# EAGLE design GU154X39LOL (EAGLE 9.6.1)
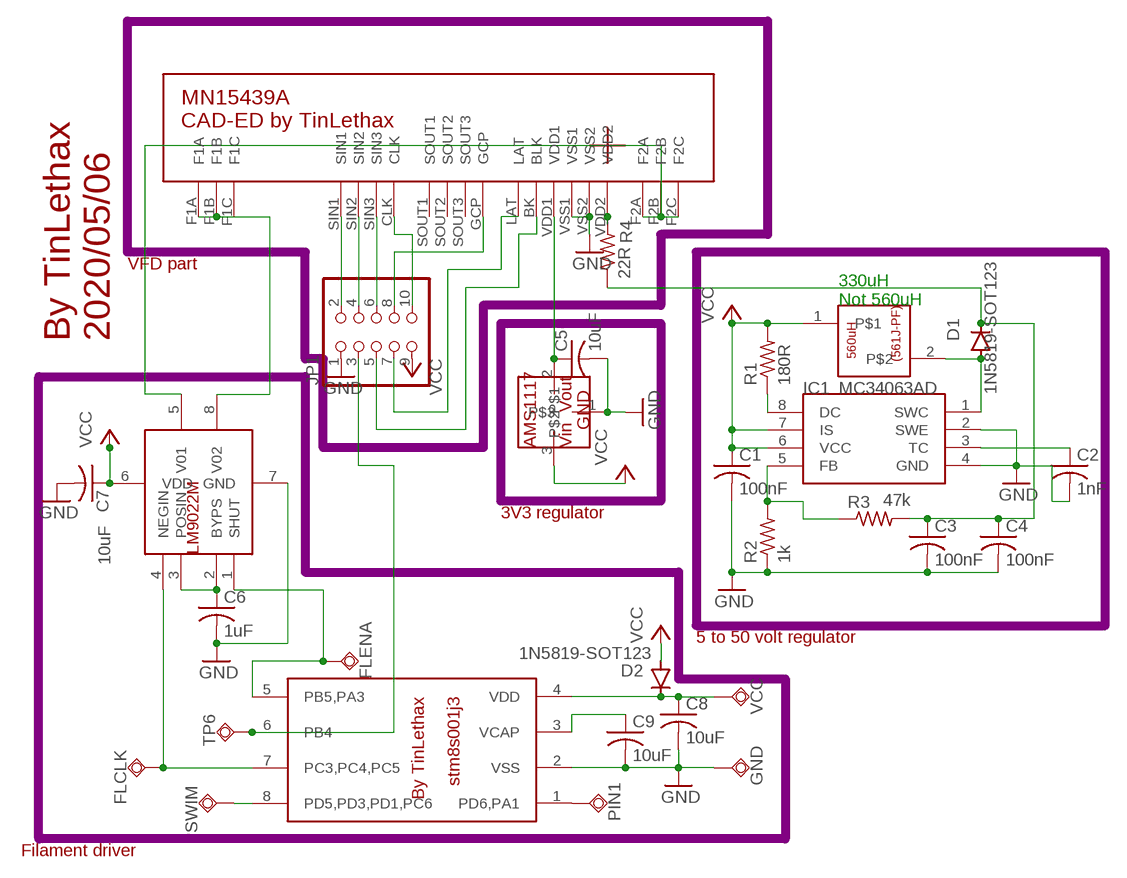
[diagram p0: schematic, sheet 1]

## Parts
330UH1210  330uH  NL453232T-561J-PF  [INDC4526X50N]
C1  100nF  C-USC1206K  [C1206K]
C2  1nF  C-USC0805  [C0805]
C3  100nF  C-USC1206K  [C1206K]
C4  100nF  C-USC1206K  [C1206K]
C5  10uF  C-USC0805  [C0805]
C6  1uF  C-USC0805  [C0805]
C7  10uF  C-USC0805  [C0805]
C8  10uF  C-USC0805  [C0805]
C9  10uF  C-USC0805  [C0805]
D1  1N5819-SOT123  CGRM400-G  [SOD-123_MINI-SMA]
D2  1N5819-SOT123  CGRM400-G  [SOD-123_MINI-SMA]
FLCLK  TPSQTP20SQ  [TP20SQ]
FLENA  TPSQTP20SQ  [TP20SQ]
GND  TPSQTP20SQ  [TP20SQ]
IC1  MC34063AD  [SOIC8]
IC2  STM8S001J3  [SOP8]
IC3  LM9022M  [SOIC127P590X265-8N]
IC4  AMS1117  [SOT223]
JP1  PINHD-2X5  [2X05]
PIN1  TPSQTP20SQ  [TP20SQ]
R1  180R  R-US_R0805  [R0805]
R2  1k  R-US_R0805  [R0805]
R3  47k  R-US_R0805  [R0805]
R4  22R  R-US_R0805  [R0805]
SWIM  TPSQTP20SQ  [TP20SQ]
TP6  TPSQTP20SQ  [TP20SQ]
U$1  MN15439A  [THT-20]
VCC  TPSQTP20SQ  [TP20SQ]

## Nets
GND: C1.2 C2.2 C3.2 C4.2 C5.2 C6.2 C7.2 C8.2 C9.2 GND.TP IC1.2(SWE) IC1.4(GND) IC2.2(VSS) IC3.7(GND) IC4.1 JP1.1 R2.1 U$1.VSS1 U$1.VSS2
N$1: IC1.8(DC) R1.1
N$2: IC1.5(FB) R2.2 R3.1
N$3: 330UH1210.2 D1.A IC1.1(SWC)
N$4: C3.1 C4.1 D1.C R3.2 R4.1
N$5: C2.1 IC1.3(TC)
N$6: C5.1 IC4.2 U$1.VDD1
N$7: IC3.5(V01) U$1.F2A U$1.F2B U$1.F2C
N$8: IC3.8(V02) U$1.F1A U$1.F1B U$1.F1C
N$9: R4.2 U$1.VDD2
N$10: JP1.2 U$1.SIN1
N$11: JP1.4 U$1.SIN2
N$12: JP1.6 U$1.SIN3
N$13: JP1.10 U$1.CLK
N$14: JP1.8 U$1.GCP
N$15: JP1.7 U$1.LAT
N$16: JP1.5 U$1.BK(BLK)
N$17: FLCLK.TP IC2.7(PC3,PC4,PC5) IC3.4(NEGIN)
N$18: C6.1 IC3.2(BYPS) IC3.3(POSIN)
N$19: FLENA.TP IC2.5(PB5,PA3) IC3.1(SHUT)
N$20: IC2.8(PD5,PD3,PD1,PC6) SWIM.TP
N$21: C8.1 D2.C IC2.4(VDD) VCC.TP
N$23: C9.1 IC2.3(VCAP)
N$25: IC2.1(PD6,PA1) PIN1.TP
N$26: IC2.6(PB4) JP1.3 TP6.TP
VCC: 330UH1210.1 C1.1 C7.1 D2.A IC1.6(VCC) IC1.7(IS) IC3.6(VDD) IC4.3 JP1.9 R1.2
Unconnected: U$1.SOUT1 U$1.SOUT2 U$1.SOUT3

## Notes on the sheet
- VFD part
- 330uH
  Not 560uH
- By TinLethax
  2020/05/06
- 3V3 regulator
- 5 to 50 volt regulator
- Filament driver

## Library data of the parts
330UH1210 = 561J-PF:NL453232T-561J-PF
C1 C3 C4 = adafruit:C-US: CAPACITOR, American symbol
C2 C5-C9 = capsmd:C-US: CAPACITOR, American symbol; SPICEPREFIX: C
D1 D2 = diode:CGRM400*-G: Molded plasitc,JEDEC SOD-123/Mini SMA Source: Comchip CGRM4001-G.pdf
FLCLK FLENA GND PIN1 SWIM TP6 VCC = testpad:TPSQ: Test pad
IC1 = mc34063:MC34063
IC2 = stm8s001j3:STM8S001J3
IC3 = LM9022:LM9022M: The LM9022 is a bridged power amplifier capable of delivering typically 2W of continuous average power into a 10Ω filament load when powered by a 5V power supply. To conserve power in portable applications, the LM9022’s micropower shutdown mode (IQ = 0.6µA, typ) is activated when VDD is applied to the SHUTDOWN pin. Additional LM9022 features include thermal shutdown protection, unity-gain stability, and external gain set; PARTNO: LM9022
IC4 = AMS1117:AMS1117: The The AMS1117 series of adjustable and fixed voltage regulators are designed to provide up to1A output current and to operate down to 1V input-to-output differential. The dropout voltage of the device is guaranteed maximum 1.3V, decreasing at lower load currents.; PARTNO: AMS1117
JP1 = pinhead:PINHD-2X5: PIN HEADER
R1-R4 = adafruit:R-US_: RESISTOR, American symbol
U$1 = MN15439A:MN15439A: This VF glass includes 3x 286 bit serial shift registers, PWM decoder and latched driver which connects to the anode and grid electrodes. An external host is required to provide a multiplexing data stream to refresh the display. The signal inputs can be connected to the ports of a CMOS microprocessor. The a.c. filament supply (F1, F2) can be derived from a source of 10KHz to 200KHz. Consult our application notes for further information.; PARTNO: MN15439A

## Board
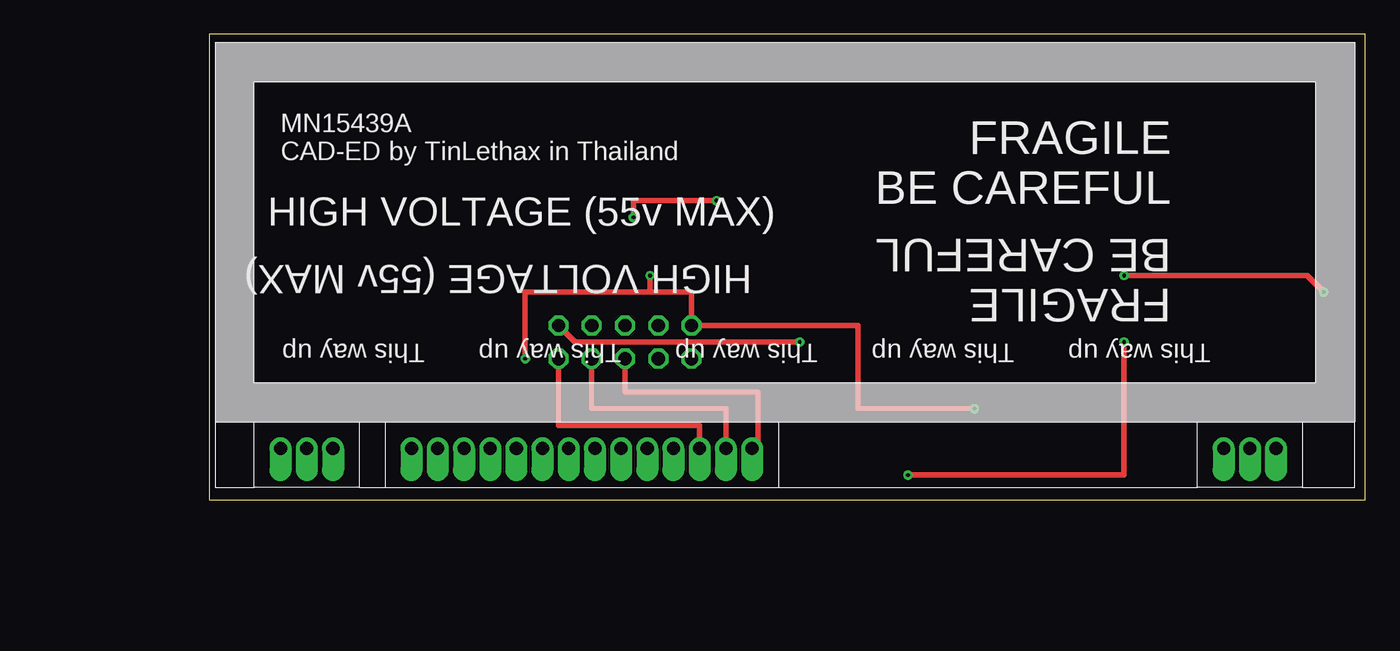
[diagram p1: board, top side]
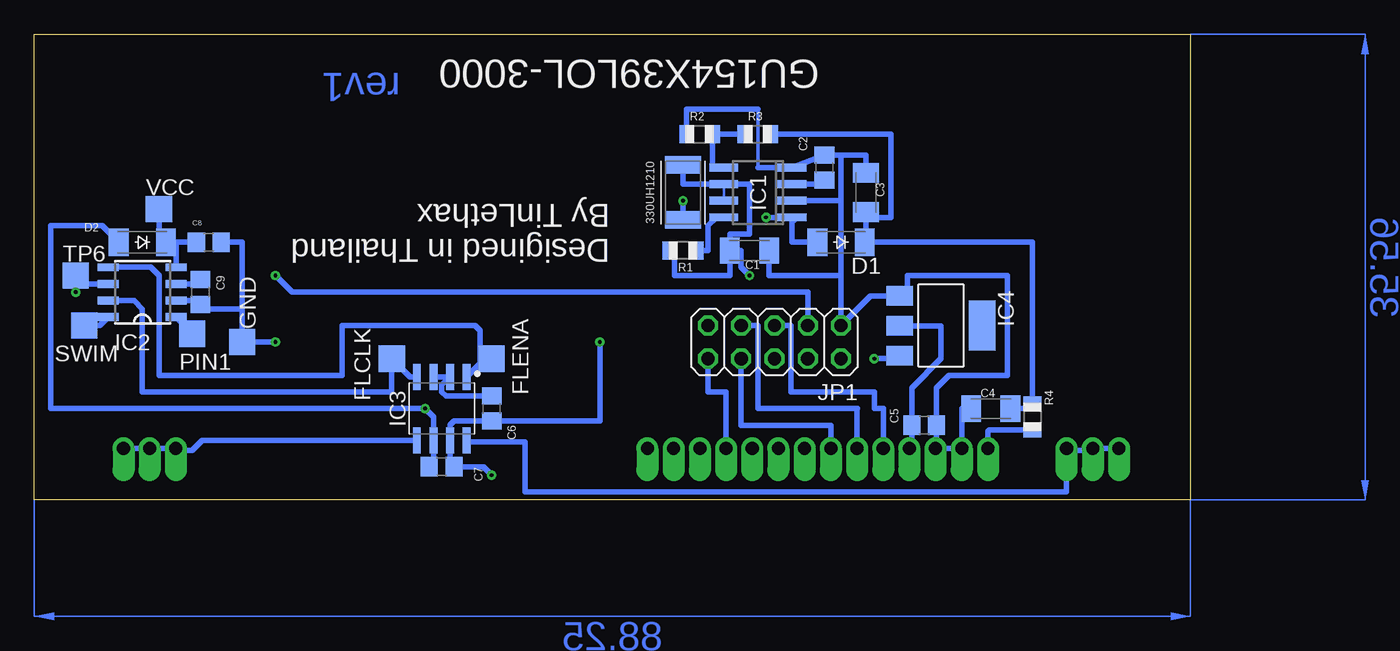
[diagram p2: board, bottom side, seen from below]

Size 88.25 x 35.56 mm. Coordinates in mm from the lower left corner, seen from the top.
Outline: 0,0 88.25,0 88.25,35.56 0,35.56 0,0
Copper layers (1*16): Top 0.035mm / dielectric 1.5mm / Bottom 0.035mm
Design rules "default": minimum track width 6mil, minimum drill 0.35mm, track to track 6mil, track to pad 6mil, pad to pad 6mil, via to via 6mil, smd to smd 6mil, copper to edge 40mil, drill to drill 6mil, minimum pad ring 10mil, minimum via ring 8mil, stop-mask expansion 4mil, vias tented up to drill 0mil, thermal gap 10mil

### Footprints (pad centres in the part's own frame; a part is rotated, then mirrored left to right if it is on the bottom)
INDC4526X50N = smd 1.314 x 2.729: 1 -2.098,0; 2 2.098,0
C1206K = smd 1.5 x 2: 1 -1.5,0; 2 1.5,0
C0805 = smd 1.3 x 1.5: 1 -0.95,0; 2 0.95,0
SOD-123_MINI-SMA = smd 1.5 x 2.1: A 1.8,0; C -1.8,0
TP20SQ = smd 2 x 2: TP 0,0
SOIC8 = smd 0.6 x 2.2: 1 -1.905,-2.6; 2 -0.635,-2.6; 3 0.635,-2.6; 4 1.905,-2.6; 5 1.905,2.6; 6 0.635,2.6; 7 -0.635,2.6; 8 -1.905,2.6
SOP8 = smd 0.6 x 1.6: 1 -1.905,-2.6; 2 -0.635,-2.6; 3 0.635,-2.6; 4 1.905,-2.6; 5 1.905,2.6; 6 0.635,2.6; 7 -0.635,2.6; 8 -1.905,2.6
SOIC127P590X265-8N = smd 1.968 x 0.602: 1 -2.423,1.905; 2 -2.423,0.635; 3 -2.423,-0.635; 4 -2.423,-1.905; 5 2.423,-1.905; 6 2.423,-0.635; 7 2.423,0.635; 8 2.423,1.905
SOT223 = smd 1.499 x 2.007: 1 -2.261,-3.15; 2 0.025,-3.15; 3 2.311,-3.15 | smd 3.81 x 2.007: 4 0,3.15
2X05 = drill 1.016 octagon: 1 -5.08,-1.27; 2 -5.08,1.27; 3 -2.54,-1.27; 4 -2.54,1.27; 5 0,-1.27; 6 0,1.27; 7 2.54,-1.27; 8 2.54,1.27; 9 5.08,-1.27; 10 5.08,1.27
R0805 = smd 1.1 x 1.4: 1 -1,0; 2 1,0
THT-20 = drill 1 pad 1.676 offset: BK -21,-17; CLK -9,-17; F1A -39,-17; F1B -37,-17; F1C -35,-17; F2A 33,-17; F2B 35,-17; F2C 37,-17; GCP -17,-17; LAT -19,-17; SIN1 -7,-17; SIN2 -5,-17; SIN3 -3,-17; SOUT1 -11,-17; SOUT2 -13,-17; SOUT3 -15,-17; VDD1 -23,-17; VDD2 -29,-17; VSS1 -25,-17; VSS2 -27,-17

### Placement (x,y rotation side)
330UH1210  38.73,23.5 270 bottom
C1  33.66,19.05 0 bottom
C2  27.94,25.4 90 bottom
C3  24.77,23.5 90 bottom
C4  15.24,6.98 180 bottom
C5  20.32,5.71 0 bottom
C6  53.34,6.98 270 bottom
C7  57.15,2.54 0 bottom
C8  74.93,19.69 0 bottom
C9  75.56,15.88 270 bottom
D1  26.67,19.69 180 bottom
D2  80.01,19.69 180 bottom
FLCLK  60.96,10.79 0 bottom
FLENA  53.34,10.79 0 bottom
GND  72.39,12.06 0 bottom
IC1  33.02,23.5 90 bottom
IC2  80.01,15.88 90 bottom
IC3  57.15,6.98 270 bottom
IC4  19.05,13.33 270 bottom
JP1  31.75,12.06 180 bottom
PIN1  76.2,12.7 0 bottom
R1  38.73,19.05 180 bottom
R2  37.46,27.94 0 bottom
R3  33.02,27.94 0 bottom
R4  12.06,6.35 270 bottom
SWIM  84.45,13.33 0 bottom
TP6  85.09,17.15 0 bottom
U$1  44.45,20.96 0 top
VCC  78.74,22.23 0 bottom

### Tracks (layer width: path | path; a pad name or v marks a point on that pad's centre or on a via)
GND  (via drill 0.3)
  Top 0.406: v69.85,12.06 69.85,1.91 v53.34,1.91 | v45.09,12.06 27.94,12.06 JP1.1
  Bottom 0.254: 33.02,29.85 33.02,25.4
  Bottom 0.406: IC2.2 75.88,15.24 C9.2 75.25,14.61 72.39,14.61 | C8.2 72.39,19.69 72.39,14.61 | 72.39,14.61 GND.TP v69.85,12.06 | v53.34,1.91 53.98,2.54 C7.2 56.52,2.86 IC3.7 56.52,5.72 56.2,6.03 C6.2 45.09,6.04 v45.09,12.06 | C2.2 IC1.4 33.02,25.4 | IC1.2 26.67,22.86 | C2.2 26.67,26.35 26.67,22.86 | 26.67,22.86 26.67,17.15 | 26.67,17.15 JP1.1 24.41,15.6 IC4.1 21.59,16.21 21.59,17.15 13.97,17.15 13.97,9.53 18.41,9.53 19.37,8.57 C5.2 19.37,3.96 U$1.VSS1 U$1.VSS2 17.45,6.98 C4.2 | C2.2 24.77,26.35 C3.2 | C1.2 32.16,17.15 26.67,17.15 | R2.1 38.46,29.85 33.02,29.85
N$1
  Bottom 0.406: R1.1 36.83,19.05 36.83,20.96 36.19,21.59 IC1.8
N$2
  Bottom 0.406: R3.1 R2.2 36.46,25.4 IC1.5
N$3  (via drill 0.3)
  Top 0.406: v38.73,22.86 32.39,22.86 v32.39,21.59
  Bottom 0.406: 30.23,21.4 IC1.1 | IC1.1 30.42,19.69 D1.A | 330UH1210.2 v38.73,22.86 | v32.39,21.59 IC1.1
N$4
  Bottom 0.406: D1.C 24.77,19.69 | 24.77,19.69 12.06,19.69 R4.1 12.43,6.98 C4.1 | C3.1 24.77,21.59 | 24.77,21.59 24.77,19.69 | R3.2 22.86,27.94 22.86,21.59 24.77,21.59
N$5
  Bottom 0.406: IC1.3 28.26,24.13 C2.1
N$6
  Bottom 0.406: U$1.VDD1 21.27,3.96 C5.1 21.27,8.58 19.05,10.79 19.05,13.31 IC4.2
N$7
  Bottom 0.406: U$1.F2C U$1.F2B U$1.F2A 77.45,3.81 76.2,3.81 75.45,4.56 IC3.5
N$8
  Bottom 0.406: U$1.F1A U$1.F1B 7.45,3.81 9.45,3.81 U$1.F1C 9.45,0.64 50.8,0.64 50.8,4.45 55.13,4.45 IC3.8
N$9
  Bottom 0.406: U$1.VDD2 15.45,5.22 15.33,5.35 R4.2
N$10
  Top 0.406: U$1.SIN1 37.45,5.71 26.67,5.71 JP1.2
N$11
  Top 0.406: JP1.4 29.21,6.98 39.45,6.98 U$1.SIN2
N$12
  Top 0.406: JP1.6 31.75,8.26 41.91,8.26 41.91,3.96 U$1.SIN3
N$13
  Bottom 0.406: U$1.CLK 35.45,8.26 36.83,8.26 JP1.10
N$14
  Bottom 0.406: U$1.GCP 27.45,5.71 34.29,5.71 JP1.8
N$15
  Bottom 0.406: U$1.LAT 25.45,6.98 | 25.45,6.98 25.4,6.98 | JP1.7 33.02,13.33 33.02,6.98 25.45,6.98
N$16
  Bottom 0.406: U$1.BK 23.45,6.98 24.13,6.98 24.13,8.26 30.48,8.26 30.48,13.33 JP1.5
N$17
  Bottom 0.406: IC3.4 59.57,9.41 FLCLK.TP 60.96,8.26 80.01,8.26 80.01,14.61 80.64,15.24 IC2.7
N$18
  Bottom 0.406: C6.1 56.83,7.93 57.15,8.26 57.15,8.77 IC3.2 IC3.3
N$19
  Bottom 0.406: IC2.5 79.38,17.78 78.74,17.15 78.74,9.53 64.77,9.53 64.77,13.33 54.61,13.33 54.23,12.96 54.23,10.42 | FLENA.TP 53.86,10.79 54.23,10.42 | 54.23,10.42 IC3.1
N$20
  Bottom 0.406: SWIM.TP 83.25,13.33 IC2.8
N$21
  Bottom 0.152: IC2.4 77.41,18.89 D2.C
  Bottom 0.406: IC2.4 77.41,19.62 77.47,19.69 C8.1 | VCC.TP 78.74,20.21 D2.C
N$23
  Bottom 0.406: IC2.3 75.88,16.51 C9.1
N$25
  Bottom 0.406: IC2.1 76.2,12.76 PIN1.TP
N$26  (via drill 0.3)
  Top 0.406: v69.85,17.15 83.82,17.15 v85.09,15.88
  Bottom 0.406: IC2.6 84.45,16.51 TP6.TP v85.09,15.88 | JP1.3 29.21,15.88 68.58,15.88 v69.85,17.15
VCC  (via drill 0.3)
  Top 0.406: 33.66,15.88 36.83,15.88 JP1.9 49.53,13.33 49.53,6.98 v58.42,6.98 | 33.66,15.88 24.13,15.88 v24.13,10.79 | 33.66,15.88 v33.66,17.15
  Bottom 0.203: IC1.7 IC1.6
  Bottom 0.406: C7.1 57.78,2.86 IC3.6 57.78,6.35 v58.42,6.98 87,6.98 87,20.96 83.08,20.96 D2.A | v24.13,10.79 22.43,10.79 IC4.3 | 330UH1210.1 38.73,24.13 IC1.6 33.66,24.13 33.66,20.32 35.16,20.32 C1.1 | R1.2 39.37,19.05 39.37,17.15 35.16,17.15 C1.1 | v33.66,17.15 34.29,17.78 34.29,19.05 C1.1
(copper drawn outside any net)
  shapes: Bottom area x2

### Text on the board
Bottom: rev1
bNames: GU154X39LOL-3000 | Desigined in Thailand / By TinLethax